# Altium schematic sheet SENSOR.SchDoc
size A4; SheetNumber: 4; SheetTotal: 5
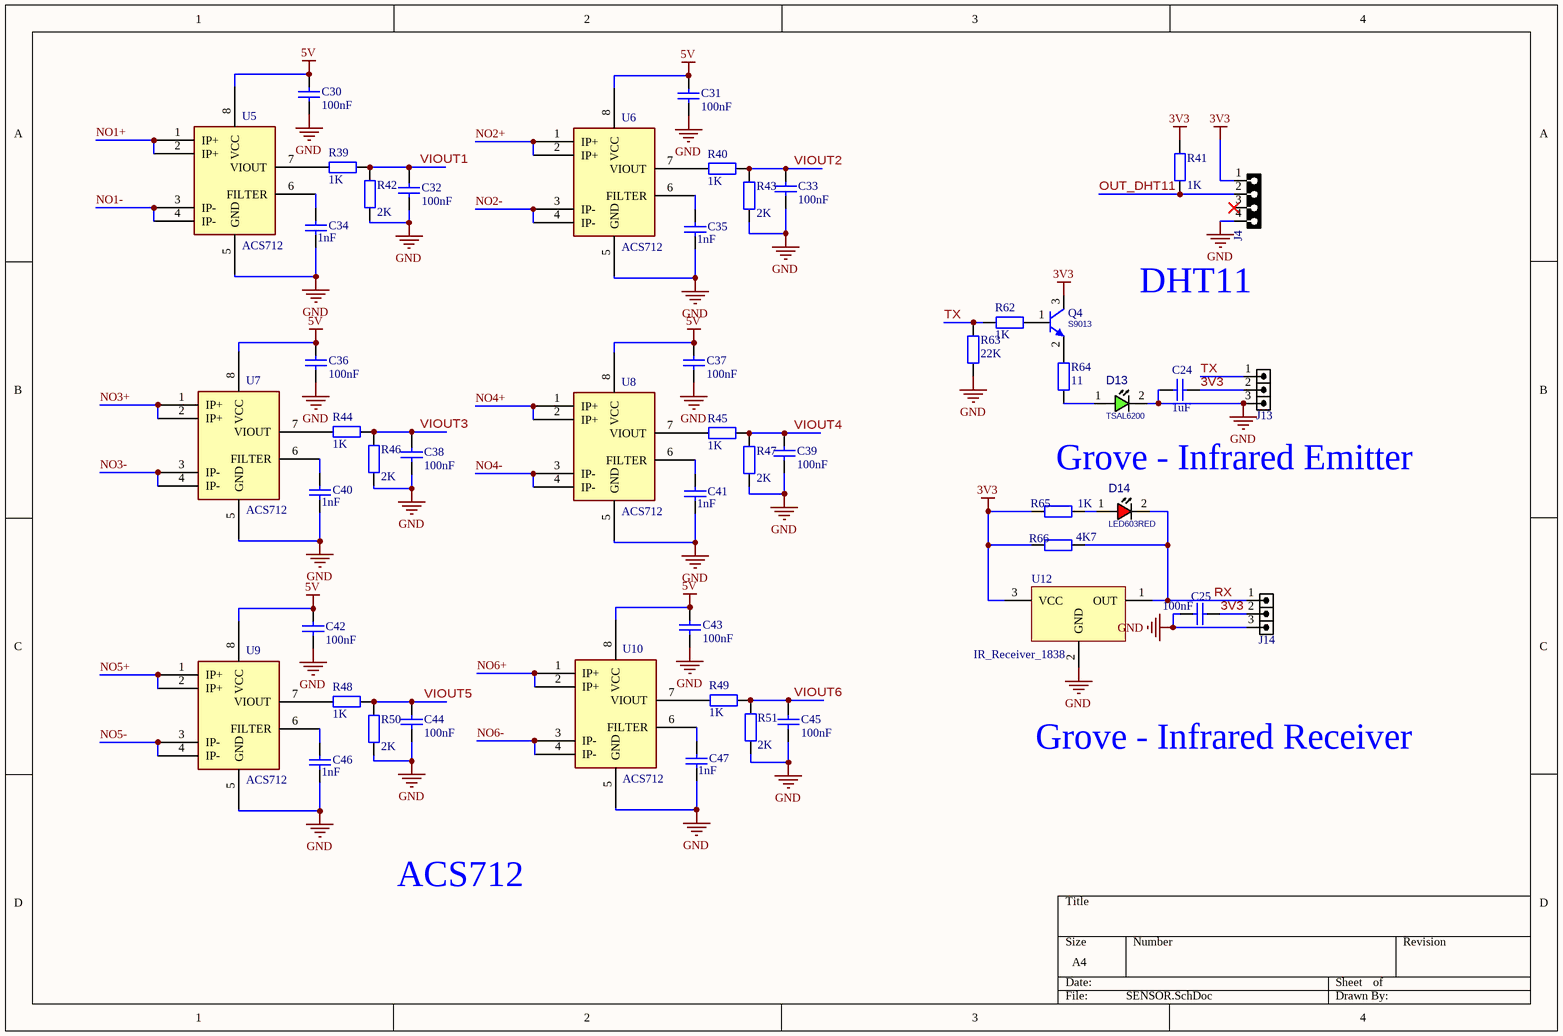
[diagram p0: SENSOR.SchDoc]

## Parts
C24  Ma_Hang: 1uF  [tu 0603]  (hidden comment: 1uF_0603_1%)
C25  Ma_Hang: 100nF  [tu 0603]  (hidden comment: 100nF_0603_1%)
C30  Ma_Hang: 100nF  [tu 0603]  (hidden comment: 100nF_0603_1%)
C31  Ma_Hang: 100nF  [tu 0603]  (hidden comment: 100nF_0603_1%)
C32  Ma_Hang: 100nF  [tu 0603]  (hidden comment: 100nF_0603_1%)
C33  Ma_Hang: 100nF  [tu 0603]  (hidden comment: 100nF_0603_1%)
C34  Ma_Hang: 1nF  [tu 0603]  (hidden comment: 1nF_0603_1%)
C35  Ma_Hang: 1nF  [tu 0603]  (hidden comment: 1nF_0603_1%)
C36  Ma_Hang: 100nF  [tu 0603]  (hidden comment: 100nF_0603_1%)
C37  Ma_Hang: 100nF  [tu 0603]  (hidden comment: 100nF_0603_1%)
C38  Ma_Hang: 100nF  [tu 0603]  (hidden comment: 100nF_0603_1%)
C39  Ma_Hang: 100nF  [tu 0603]  (hidden comment: 100nF_0603_1%)
C40  Ma_Hang: 1nF  [tu 0603]  (hidden comment: 1nF_0603_1%)
C41  Ma_Hang: 1nF  [tu 0603]  (hidden comment: 1nF_0603_1%)
C42  Ma_Hang: 100nF  [tu 0603]  (hidden comment: 100nF_0603_1%)
C43  Ma_Hang: 100nF  [tu 0603]  (hidden comment: 100nF_0603_1%)
C44  Ma_Hang: 100nF  [tu 0603]  (hidden comment: 100nF_0603_1%)
C45  Ma_Hang: 100nF  [tu 0603]  (hidden comment: 100nF_0603_1%)
C46  Ma_Hang: 1nF  [tu 0603]  (hidden comment: 1nF_0603_1%)
C47  Ma_Hang: 1nF  [tu 0603]  (hidden comment: 1nF_0603_1%)
D13  TSAL6200  [LED3MM]
D14  LED603RED  [LED0603RED]
J4  HDRF4  [HDR_F_1X4]  (value not drawn)
J13  HDRM3  [HDR_M_1X3]  (value not drawn)
J14  HDRM3  [HDR_M_1X3]  (value not drawn)
Q4  S9013  [SOT23_3]
R39  Ma_Hang: 1K  [tro smd 0603]  (hidden comment: 1K_0603_1%)
R40  Ma_Hang: 1K  [tro smd 0603]  (hidden comment: 1K_0603_1%)
R41  Ma_Hang: 1K  [tro smd 0603]  (hidden comment: 1K_0603_1%)
R42  Ma_Hang: 2K  [tro smd 0603]  (hidden comment: 2K_0603_1%)
R43  Ma_Hang: 2K  [tro smd 0603]  (hidden comment: 2K_0603_1%)
R44  Ma_Hang: 1K  [tro smd 0603]  (hidden comment: 1K_0603_1%)
R45  Ma_Hang: 1K  [tro smd 0603]  (hidden comment: 1K_0603_1%)
R46  Ma_Hang: 2K  [tro smd 0603]  (hidden comment: 2K_0603_1%)
R47  Ma_Hang: 2K  [tro smd 0603]  (hidden comment: 2K_0603_1%)
R48  Ma_Hang: 1K  [tro smd 0603]  (hidden comment: 1K_0603_1%)
R49  Ma_Hang: 1K  [tro smd 0603]  (hidden comment: 1K_0603_1%)
R50  Ma_Hang: 2K  [tro smd 0603]  (hidden comment: 2K_0603_1%)
R51  Ma_Hang: 2K  [tro smd 0603]  (hidden comment: 2K_0603_1%)
R62  Ma_Hang: 1K  [tro smd 0603]  (hidden comment: 1K_0603_1%)
R63  Ma_Hang: 22K  [tro smd 0603]  (hidden comment: 22K_0603_1%)
R64  Ma_Hang: 11  [tro smd 0603]  (hidden comment: 11_0603_1%)
R65  Ma_Hang: 1K  [tro smd 0603]  (hidden comment: 1K_0603_1%)
R66  Ma_Hang: 4K7  [tro smd 0603]  (hidden comment: 4K7_0603_1%)
U5  value ACS712  [SO_8]  (hidden comment: ACS712_8SOIC)
U6  value ACS712  [SO_8]  (hidden comment: ACS712_8SOIC)
U7  value ACS712  [SO_8]  (hidden comment: ACS712_8SOIC)
U8  value ACS712  [SO_8]  (hidden comment: ACS712_8SOIC)
U9  value ACS712  [SO_8]  (hidden comment: ACS712_8SOIC)
U10  value ACS712  [SO_8]  (hidden comment: ACS712_8SOIC)
U12  IR_Receiver_1838  [IR_1838]

## Nets
3V3: C24.2 C25.2 J4.1 J13.2 J14.2 Q4.3(C) R41.2 R65.2 R66.2 U12.3(VCC)
5V: C30.1 C31.1 C36.1 C37.1 C42.1 C43.1 U5.8(VCC) U6.8(VCC) U7.8(VCC) U8.8(VCC) U9.8(VCC) U10.8(VCC)
GND: C24.1 C25.1 C30.2 C31.2 C32.2 C33.2 C34.2 C35.2 C36.2 C37.2 C38.2 C39.2 C40.2 C41.2 C42.2 C43.2 C44.2 C45.2 C46.2 C47.2 D13.2(CATHODE) J4.4 J13.3 J14.3 R42.1 R43.1 R46.1 R47.1 R50.1 R51.1 R63.1 U5.5(GND) U6.5(GND) U7.5(GND) U8.5(GND) U9.5(GND) U10.5(GND) U12.2(GND)
NO1+: U5.1(IP+) U5.2(IP+)
NO1-: U5.3(IP-) U5.4(IP-)
NO2+: U6.1(IP+) U6.2(IP+)
NO2-: U6.3(IP-) U6.4(IP-)
NO3+: U7.1(IP+) U7.2(IP+)
NO3-: U7.3(IP-) U7.4(IP-)
NO4+: U8.1(IP+) U8.2(IP+)
NO4-: U8.3(IP-) U8.4(IP-)
NO5+: U9.1(IP+) U9.2(IP+)
NO5-: U9.3(IP-) U9.4(IP-)
NO6+: U10.1(IP+) U10.2(IP+)
NO6-: U10.3(IP-) U10.4(IP-)
OUT_DHT11: J4.2 R41.1
RX: D14.2(CATHODE) J14.1 R66.1 U12.1(OUT)
TX: J13.1 R62.1 R63.2
VIOUT1: C32.1 R39.1 R42.2
VIOUT2: C33.1 R40.1 R43.2
VIOUT3: C38.1 R44.1 R46.2
VIOUT4: C39.1 R45.1 R47.2
VIOUT5: C44.1 R48.1 R50.2
VIOUT6: C45.1 R49.1 R51.2
NetC34_1: C34.1 U5.6(FILTER)
NetC35_1: C35.1 U6.6(FILTER)
NetC40_1: C40.1 U7.6(FILTER)
NetC41_1: C41.1 U8.6(FILTER)
NetC46_1: C46.1 U9.6(FILTER)
NetC47_1: C47.1 U10.6(FILTER)
NetD13_1: D13.1(ANODE) R64.2
NetD14_1: D14.1(ANODE) R65.1
NetQ4_1: Q4.1(B) R62.2
NetQ4_2: Q4.2(E) R64.1
NetR39_2: R39.2 U5.7(VIOUT)
NetR40_2: R40.2 U6.7(VIOUT)
NetR44_2: R44.2 U7.7(VIOUT)
NetR45_2: R45.2 U8.7(VIOUT)
NetR48_2: R48.2 U9.7(VIOUT)
NetR49_2: R49.2 U10.7(VIOUT)

Not connected (* = marked no-connect by the designer): J4 3*

## Notes on the sheet
- (near J4) DHT11
- Grove - Infrared Emitter
- Grove - Infrared Receiver
- ACS712

## Library data of the parts
C24 C25 C30-C47 = Tu 0603 470pF 50V 10%: Capacitor, Ceramic, 50V; Chung_Loai: Dán; Don_Vi: Con; So_Chan: 2; Ten_Linh_Kien: Tụ 0603 470P 50V 10%; Kieu_Chan: *
D13 = LED_THD_3MM: LED, THD, 3MM, GREEN; DESC: DESCRIPTION; MANF_P#: MANF_PART#; PARAM2: 2.2V; MANF: MANF; ASSEMBLY: ASSEMBLY; PRICE: PRICE; VALUE: TSAL6200
D14 = LED_SMD_0603_RED: LED, SMD, 0603, RED; PARAM: 30mA, 640nm; DESC: DESCRIPTION; MANF_P#: MANF_PART#; PARAM2: 1.8~2.5V; MANF: MANF; ASSEMBLY: ASSEMBLY; PRICE: PRICE; VALUE: LED603RED
J4 = HDR_F_1X4: CONN, HEADER, Female, pitch: 2.54mm, 4POS; VALUE: HDRF4
J13 J14 = HDR_M_1X3: CONN, HEADER, Male, pitch: 2.54mm, 3POS; VALUE: HDRM3
Q4 = NPN_SS8050_SOT23: BJT, NPN, 25v, 1.5A, SMD, SOT23; PARAM2: 300mW; MANF_P#: SS8050; MANF: GALAXY; PARAM: 25v, 1.5A; VALUE: S9013
R39-R51 R62-R66 = Tro 0603 5% 10k: RES SMD 0603; Chung_Loai: Dán; Don_Vi: Con; So_Chan: 2; Ten_Linh_Kien: Trở 0603 5% 10k; Kieu_Chan: *
U5-U10 = ACS712: IC, CURRENT SENSOR, HALL EFFECT; MANF: Allegro; PARAM2: 5Vcc, 80KHz BW; PARAM: 66~185mV/A, 20/30A max, -40~85oC; MANF_P#: ACS712
U12 = IR_1838: 1A Regulator